# Altium schematic sheet 1_P1.schdoc
size 307 x 218 mm; Symbol: Drawing-Symbol_A4; Device: Drawing-Symbol_A4; @Project Name: thekob; @Page Count: 1; @Update Date: 2025-08-31; @Create Date: 2025-08-30; @Schematic Name: Schematic1; @Page No: 1; @Page Name: P1; Company: EasyEDA.com; Version: V1.0; Page Size: A4; @Create Time: 20:28:46; @Update Time: 09:54:26; Width: 1170; Height: 825; Region Start: 1; X Region Count: 6; Y Region Count: 4; Blade Width: 10; Title Block Position: 3; @Board Name: Board1
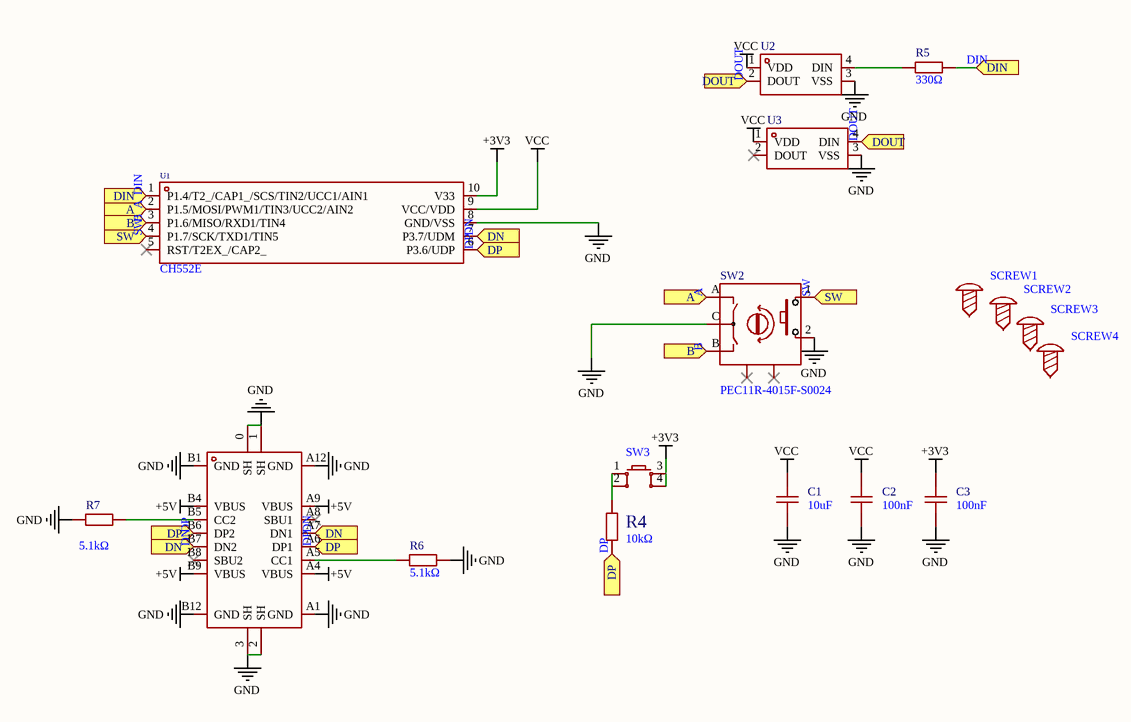
[diagram p0: 1_P1.schdoc]

## Parts
C1  10uF  [C0603]
C2  100nF  [C0603]
C3  100nF  [C0603]
R4  10kΩ  [R0603]
R5  330Ω  [R0603]
R6  5.1kΩ  [R0603]
R7  5.1kΩ  [R0603]
SCREW1  (no value)  [Screw-Hole-M2]
SCREW2  (no value)  [Screw-Hole-M2]
SCREW3  (no value)  [Screw-Hole-M2]
SCREW4  (no value)  [Screw-Hole-M2]
SW2  PEC11R-4015F-S0024  [SW-TH_PEC11R-4XXXF-SXXXX]
SW3  (no value)  [KEY-TH_4P-L6.0-W6.0-P3.90-LS6.5]
U1  CH552E  [MSOP-10_L3.0-W3.0-P0.50-LS5.0-BL]
U2  WS2812B-HS01/W  [LED-SMD_4P-L5.0-W5.0-TL-1]  (value not drawn)
U3  WS2812B-HS01/W  [LED-SMD_4P-L5.0-W5.0-TL-1]  (value not drawn)
USBC2  TYPE-C-31-M-12  [USB-C_SMD-TYPE-C-31-M-12]  (value not drawn)

## Ports
A (in), B (in), DIN (in), DN (in), DOUT (in), DP (in), SW (in)

## Nets
+3V3: C3.2 U1.10(V33)
+5V: USBC2.A4(VBUS) USBC2.A9(VBUS) USBC2.B4(VBUS) USBC2.B9(VBUS)
GND: C1.1 C2.1 C3.1 R6.2 R7.1 SW2.2 SW2.C U1.8(GND/VSS) U2.3(VSS) U3.3(VSS) USBC2.0(SH) USBC2.1(SH) USBC2.2(SH) USBC2.3(SH) USBC2.A1(GND) USBC2.A12(GND) USBC2.B1(GND) USBC2.B12(GND)
VCC: C1.2 C2.2 U1.9(VCC/VDD) U2.1(VDD) U3.1(VDD)
A: SW2.A U1.2(P1.5/MOSI/PWM1/TIN3/UCC2/AIN2) ; port A
B: SW2.B U1.3(P1.6/MISO/RXD1/TIN4) ; port B
DIN: R5.2 U1.1(P1.4/T2_/CAP1_/SCS/TIN2/UCC1/AIN1) ; port DIN
DN: U1.7(P3.7/UDM) USBC2.A7(DN1) USBC2.B7(DN2) ; port DN
DOUT: U2.2(DOUT) U3.4(DIN) ; port DOUT
DP: R4.1 U1.6(P3.6/UDP) USBC2.A6(DP1) USBC2.B6(DP2) ; port DP
SW: SW2.1 U1.4(P1.7/SCK/TXD1/TIN5) ; port SW
NetR4_2: R4.2 SW3.1 SW3.2
NetR5_1: R5.1 U2.4(DIN)
NetR6_1: R6.1 USBC2.A5(CC1)
NetR7_2: R7.2 USBC2.B5(CC2)
NetSW3_3: SW3.3 SW3.4

Not connected (* = marked no-connect by the designer): SCREW1 1; SCREW2 1; SCREW3 1; SCREW4 1; SW2 MT1* MT2*; U1 5(RST/T2EX_/CAP2_)*; U3 2(DOUT)*; USBC2 A8(SBU1)* B8(SBU2)*

## Notes on the sheet
- 1
- 2
- 3
- 4
- 5
- 6
- A
- B
- C
- Schematic
- Schematic1
- Create at
- Update at
- 2025-08-30
- 2025-08-31
- Board
- Drawn
- Board1
- Page
- P1
- D
- Reviewed
- Version
- Size
- thekob
- Page  1  Total  1
- V1.0
- A4
- EasyEDA.com

## Library data of the parts
C1 = CL10A106KP8NNNC: Manufacturer: SAMSUNG(三星); Add into BOM: yes; Tolerance: ±10%; Voltage Rating: 10V; Temperature Coefficient: X5R; Symbol: CL10A106KP8NNNC; Device: CL10A106KP8NNNC; LCSC Part Name: 10uF ±10% 10V; Supplier Part: C19702; Manufacturer Part: CL10A106KP8NNNC; Supplier Footprint: 0603; JLCPCB Part Class: Basic Part; Datasheet: https://item.szlcsc.com/datasheet/CL10A106KP8NNNC/20411.html; Supplier: LCSC; Convert to PCB: yes; Value: 10uF
C2 C3 = CC0603KRX7R9BB104: Manufacturer: YAGEO(国巨); Add into BOM: yes; Tolerance: ±10%; Voltage Rating: 50V; Temperature Coefficient: X7R; Symbol: CC0603KRX7R9BB104; Device: CC0603KRX7R9BB104; LCSC Part Name: 100nF ±10% 50V; Supplier Part: C14663; Manufacturer Part: CC0603KRX7R9BB104; Supplier Footprint: 0603; JLCPCB Part Class: Basic Part; Datasheet: https://item.szlcsc.com/datasheet/CC0603KRX7R9BB104/15331.html; Supplier: LCSC; Convert to PCB: yes; Value: 100nF
R4 = 0603WAF1002T5E: Manufacturer: UNI-ROYAL(厚声); Add into BOM: yes; Tolerance: ±1%; Power(Watts): 100mW; Voltage-Supply(Max): 75V; Temperature Coefficient: ±100ppm/℃; Symbol: 0603WAF1002T5E; Device: 0603WAF1002T5E; LCSC Part Name: 厚膜电阻 10kΩ ±1% 100mW; Supplier Part: C25804; Manufacturer Part: 0603WAF1002T5E; Supplier Footprint: 0603; JLCPCB Part Class: Basic Part; Datasheet: https://item.szlcsc.com/datasheet/0603WAF1002T5E/26547.html; Supplier: LCSC; Convert to PCB: yes; Type: Thick Film Resistor; Value: 10kΩ; Operating Temperature: -55℃~+155℃
R5 = 0603WAF3300T5E: Manufacturer: UNI-ROYAL(厚声); Add into BOM: yes; Tolerance: ±1%; Temperature Coefficient: ±100ppm/℃; Symbol: 0603WAF3300T5E; Device: 0603WAF3300T5E; LCSC Part Name: 330Ω ±1% 100mW 厚膜电阻; Supplier Part: C23138; Manufacturer Part: 0603WAF3300T5E; Supplier Footprint: 0603; JLCPCB Part Class: Basic Part; Datasheet: https://atta.szlcsc.com/upload/public/pdf/source/20200306/C422600_1E6D84923E4A46A82E41ADD87F860B5C.pdf; Supplier: LCSC; Convert to PCB: yes; Type: Thick Film Resistors; Value: 330Ω; Operating Temperature Range: -55℃~+155℃
R6 R7 = 0603WAF5101T5E: Manufacturer: UNI-ROYAL(厚声); Add into BOM: yes; Tolerance: ±1%; Power(Watts): 100mW; Voltage-Supply(Max): 75V; Temperature Coefficient: ±100ppm/℃; Symbol: 0603WAF5101T5E; Device: 0603WAF5101T5E; LCSC Part Name: 5.1kΩ ±1% 100mW 厚膜电阻; Supplier Part: C23186; Manufacturer Part: 0603WAF5101T5E; Supplier Footprint: 0603; JLCPCB Part Class: Basic Part; Datasheet: https://item.szlcsc.com/datasheet/0603WAF5101T5E/23913.html; Supplier: LCSC; Convert to PCB: yes; Type: Thick Film Resistor; Value: 5.1kΩ; Operating Temperature: -55℃~+155℃
SCREW1-SCREW4 = Screw-Hole-M2: Add into BOM: yes; Symbol: Screw-Hole; Device: Screw-Hole-M2; Convert to PCB: yes; Supplier Footprint: 插件
SW2 = PEC11R-4015F-S0024: Manufacturer: BOURNS; Add into BOM: yes; Symbol: PEC11R-4015F-S0024; Device: PEC11R-4015F-S0024; LCSC Part Name: 三件套 PEC11R-4015F-S0024（三件套）; Supplier Part: C143789; Manufacturer Part: PEC11R-4015F-S0024; Supplier Footprint: 插件; JLCPCB Part Class: Extended Part; Datasheet: https://item.szlcsc.com/datasheet/PEC11R-4015F-S0024/155120.html; Supplier: LCSC; Convert to PCB: yes
SW3 = Key_TH_6x6x4.5: Symbol: 轻触按键; Convert to PCB: yes; Device: Key_TH_6x6x4.5; Add into BOM: yes; Supplier Footprint: Through
U1 = CH552E: Manufacturer: WCH(南京沁恒); Add into BOM: yes; CPU Core: 51Series; Program Storage Size: 16KB; RAM Size: 1.25KB; Operating Voltage Range: 3.3V~5V; CPU Maximum Speed: 24MHz; Program Memory Type: FLASH; ADC (Bit): 8bit; 16Bit Timer: 3; UART/USART: 2; SPI: 1; Universal Serial Bus: 有; Peripheral/Function: DMA；WDT；CCP捕获/比较；Touch button; Symbol: CH552E; Device: CH552E; Supplier: LCSC; Supplier Part: C967938; Manufacturer Part: CH552E; JLCPCB Part Class: Extended Part; LCSC Part Name: CH552E; Supplier Footprint: MSOP-10; Datasheet: https://atta.szlcsc.com/upload/public/pdf/source/20210113/C967938_1C35FF7046C581C5764B019C00B201EC.pdf; Convert to PCB: yes; GPIO Ports Number: -; Operating Temperature Range: -40℃~+85℃; DAC (Bit): -; PWM (Bit): 8bit; 8Bit Timer: -; 32Bit Timer: -; CAN: -; I2C: -; I2S: -; Internal Comparator: -; communication protocol: -; Watchdog: 有; Real-Time Clock: -; Infrared Data Association: -; Low-Voltage Detect: -; CCP Capture/Compare: 有; Secure Digital Input and Output: -; Direct Memory Access: 有; Internal Oscillator: 有
U2 U3 = WS2812B-HS01/W: Manufacturer: worldsemi; Add into BOM: yes; Symbol: WS2812B-HS01/W; Device: WS2812B-HS01/W; LCSC Part Name: SMD灯珠,RGB三色; Supplier Part: C22371521; Manufacturer Part: WS2812B-HS01/W; Supplier Footprint: SMD-4P,5x5mm; JLCPCB Part Class: Extended Part; Datasheet: https://atta.szlcsc.com/upload/public/pdf/source/20240329/A5FB37D4E0BB93013EC3B2B50464A7C5.pdf; Supplier: LCSC; Convert to PCB: yes
USBC2 = TYPE-C-31-M-12: Manufacturer: 韩国韩荣; Add into BOM: yes; Connector Type: Type-C; Gender: Female; Number of Contacts: 16P; Number of Ports: 1; Current Rating - Power (Max): 5A; Symbol: TYPE-C-31-M-12; Device: TYPE-C-31-M-12; LCSC Part Name: Type-C 母; Supplier Part: C165948; Manufacturer Part: TYPE-C-31-M-12; Supplier Footprint: SMD; JLCPCB Part Class: Extended Part; Datasheet: https://atta.szlcsc.com/upload/public/pdf/source/20220525/466408E853115E789EDB0DDC29077C05.pdf; Supplier: LCSC; Convert to PCB: yes; Standard: -; Mounting Style: -; Operating Temperature Range: -